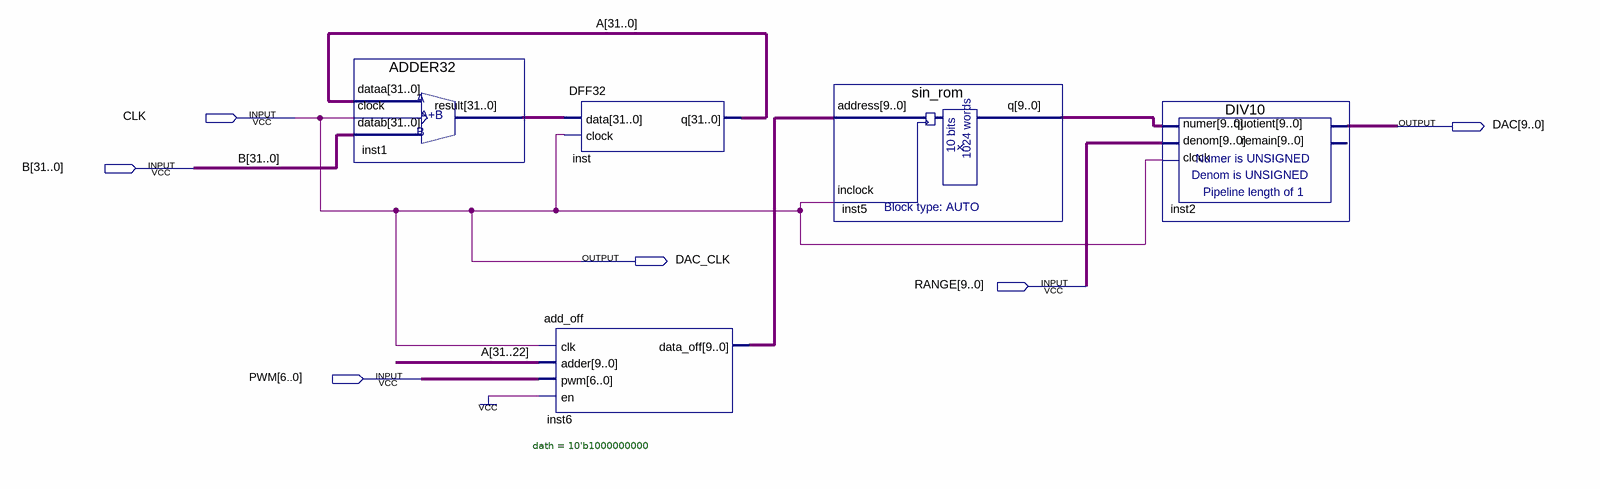
[diagram p0: schematic sheet]
// Quartus schematic DDS.bdf as structural Verilog: 5 symbols, 6 pins
module DDS (
  input  CLK,
  input  [31:0] B,
  input  [9:0] RANGE,
  input  [6:0] PWM,
  output [9:0] DAC,
  output DAC_CLK
);

  wire [9:0] inst5_q, inst6_data_off;
  wire [31:0] A, inst1_result;

  ADDER32 inst1 (.dataa(A), .datab(B), .clock(CLK), .result(inst1_result));
  DFF32 inst (.data(inst1_result), .clock(CLK), .q(A));
  add_off #(.dath(10'b1000000000)) inst6 (.clk(CLK), .adder(A[31:22]), .pwm(PWM), .en(1'b1), .data_off(inst6_data_off));
  sin_rom inst5 (.address(inst6_data_off), .inclock(CLK), .q(inst5_q));
  DIV10 inst2 (.numer(inst5_q), .denom(RANGE), .clock(CLK), .quotient(DAC));  // open: remain

  assign DAC_CLK = CLK;
endmodule
